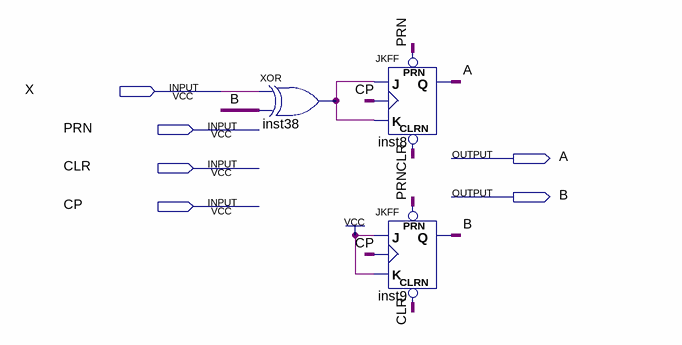
[diagram p0: schematic sheet]
// Quartus schematic PracticeProblem2.bdf as structural Verilog: 3 symbols, 6 pins
module PracticeProblem2 (
  input  X,
  input  PRN,
  input  CLR,
  input  CP,
  output A,
  output B
);

  wire inst38_out;

  xor inst38 (inst38_out, X, B);
  JKFF inst8 (.PRN(PRN), .CLRN(CLR), .K(inst38_out), .J(inst38_out), .CLK(CP), .Q(A));
  JKFF inst9 (.PRN(PRN), .CLRN(CLR), .K(1'b1), .J(1'b1), .CLK(CP), .Q(B));
endmodule
